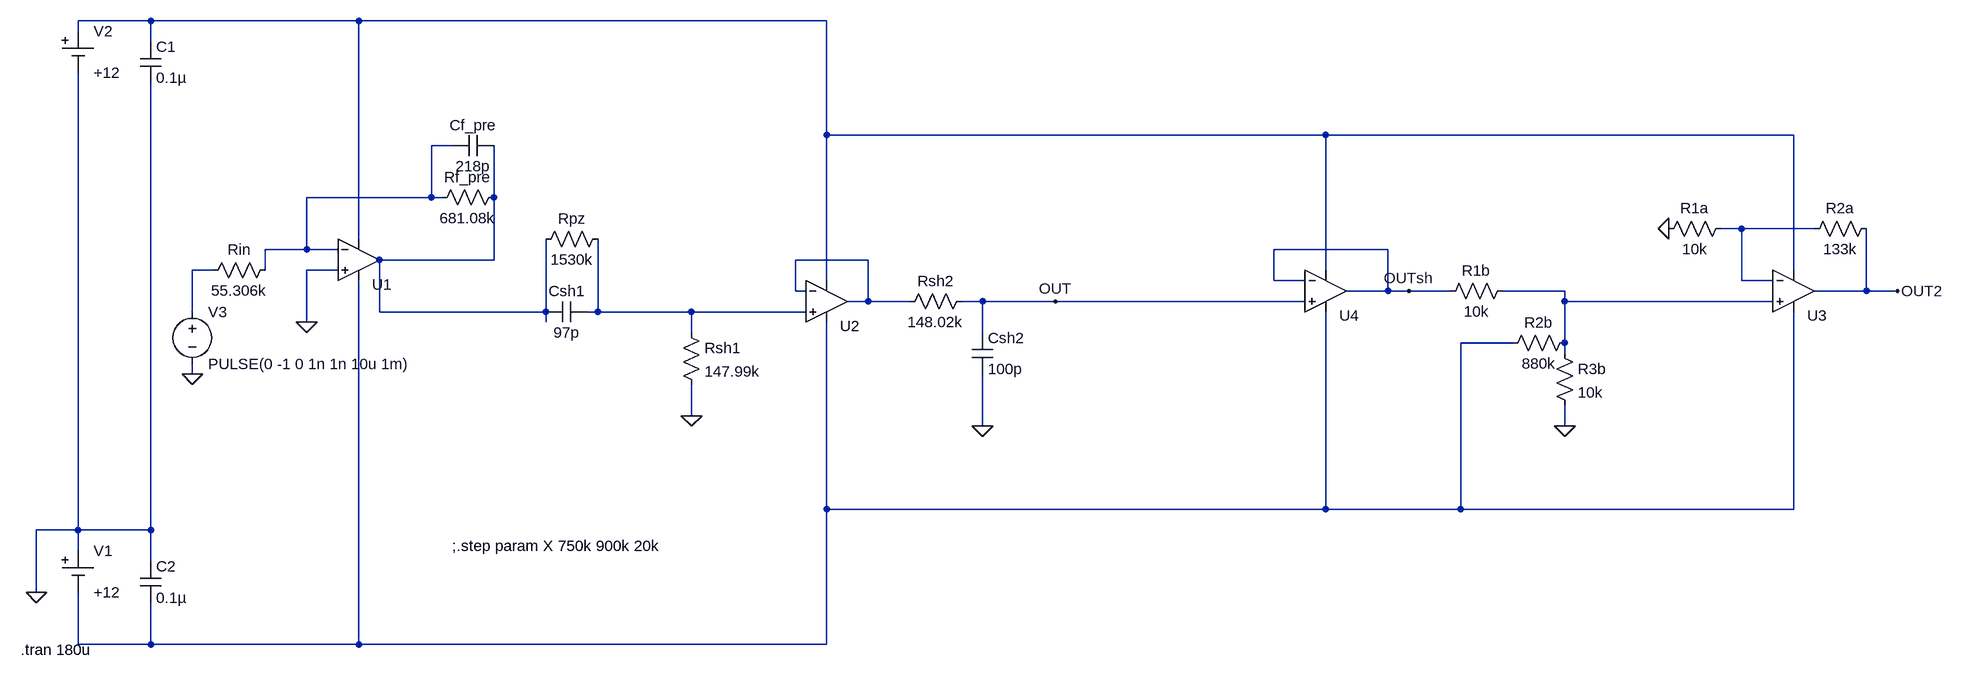
[diagram p0: schematic Circ_4.asc]
Circ_4.asc, the LTspice schematic file:
Version 4
SHEET 1 2336 680
WIRE -432 -624 -544 -624
WIRE -112 -624 -432 -624
WIRE 608 -624 -112 -624
WIRE -544 -608 -544 -624
WIRE -432 -592 -432 -624
WIRE 608 -448 608 -624
WIRE 1376 -448 608 -448
WIRE 2096 -448 1376 -448
WIRE 32 -432 0 -432
WIRE 0 -352 0 -432
WIRE 0 -352 -192 -352
WIRE 16 -352 0 -352
WIRE 96 -352 96 -432
WIRE 2016 -304 1984 -304
WIRE 2128 -304 2016 -304
WIRE -112 -288 -112 -624
WIRE -192 -272 -192 -352
WIRE -192 -272 -256 -272
WIRE -144 -272 -192 -272
WIRE 1472 -272 1296 -272
WIRE 96 -256 96 -352
WIRE 96 -256 -80 -256
WIRE 672 -256 560 -256
WIRE -336 -240 -368 -240
WIRE -256 -240 -256 -272
WIRE -144 -240 -192 -240
WIRE 1376 -240 1376 -448
WIRE 2096 -240 2096 -448
WIRE 608 -224 608 -448
WIRE 1296 -224 1296 -272
WIRE 1344 -224 1296 -224
WIRE 2016 -224 2016 -304
WIRE 2064 -224 2016 -224
WIRE 560 -208 560 -256
WIRE 576 -208 560 -208
WIRE 1472 -208 1472 -272
WIRE 1472 -208 1408 -208
WIRE 1504 -208 1472 -208
WIRE 1568 -208 1504 -208
WIRE 1744 -208 1648 -208
WIRE 2208 -208 2208 -304
WIRE 2208 -208 2128 -208
WIRE 2256 -208 2208 -208
WIRE 672 -192 672 -256
WIRE 672 -192 640 -192
WIRE 736 -192 672 -192
WIRE 848 -192 816 -192
WIRE 960 -192 848 -192
WIRE 1344 -192 960 -192
WIRE 1744 -192 1744 -208
WIRE 2064 -192 1744 -192
WIRE -368 -176 -368 -240
WIRE -80 -176 -80 -256
WIRE 176 -176 176 -288
WIRE 176 -176 -80 -176
WIRE 256 -176 256 -288
WIRE 256 -176 240 -176
WIRE 400 -176 256 -176
WIRE 576 -176 400 -176
WIRE -192 -160 -192 -240
WIRE 176 -160 176 -176
WIRE 400 -144 400 -176
WIRE 848 -144 848 -192
WIRE 1664 -128 1584 -128
WIRE 1744 -128 1744 -192
WIRE 1744 -112 1744 -128
WIRE -368 -80 -368 -96
WIRE 400 -16 400 -64
WIRE 848 0 848 -80
WIRE 1744 0 1744 -32
WIRE 608 128 608 -160
WIRE 1376 128 1376 -176
WIRE 1376 128 608 128
WIRE 1584 128 1584 -128
WIRE 1584 128 1376 128
WIRE 2096 128 2096 -176
WIRE 2096 128 1584 128
WIRE -544 160 -544 -544
WIRE -544 160 -608 160
WIRE -432 160 -432 -528
WIRE -432 160 -544 160
WIRE -544 192 -544 160
WIRE -432 208 -432 160
WIRE -608 256 -608 160
WIRE -544 336 -544 256
WIRE -432 336 -432 272
WIRE -432 336 -544 336
WIRE -112 336 -112 -224
WIRE -112 336 -432 336
WIRE 608 336 608 128
WIRE 608 336 -112 336
FLAG -608 256 0
FLAG 400 -16 0
FLAG 848 0 0
FLAG 960 -192 OUT
FLAG -368 -80 0
FLAG -192 -160 0
FLAG 2256 -208 OUT2
FLAG 1904 -304 0
FLAG 1744 0 0
FLAG 1504 -208 OUTsh
SYMBOL cap -448 208 R0
SYMATTR InstName C2
SYMATTR Value 0.1µ
SYMBOL Misc\\cell -544 192 R0
WINDOW 123 0 0 Left 0
WINDOW 39 0 0 Left 0
SYMATTR InstName V1
SYMATTR Value +12
SYMBOL Misc\\cell -544 -608 R0
WINDOW 123 0 0 Left 0
WINDOW 39 0 0 Left 0
SYMATTR InstName V2
SYMATTR Value +12
SYMBOL cap -448 -592 R0
SYMATTR InstName C1
SYMATTR Value 0.1µ
SYMBOL Opamps/UniversalOpamp2 608 -192 R0
WINDOW 0 21 38 Left 2
SYMATTR InstName U2
SYMBOL cap 240 -192 R90
WINDOW 0 0 32 VBottom 2
WINDOW 3 32 32 VTop 2
SYMATTR InstName Csh1
SYMATTR Value 97p
SYMBOL res 384 -160 R0
SYMATTR InstName Rsh1
SYMATTR Value 147.99k
SYMBOL res 832 -208 R90
WINDOW 0 0 56 VBottom 2
WINDOW 3 32 56 VTop 2
SYMATTR InstName Rsh2
SYMATTR Value 148.02k
SYMBOL cap 832 -144 R0
SYMATTR InstName Csh2
SYMATTR Value 100p
SYMBOL Opamps/UniversalOpamp2 -112 -256 R0
WINDOW 0 21 38 Left 2
SYMATTR InstName U1
SYMBOL res 112 -368 R90
WINDOW 0 0 56 VBottom 2
WINDOW 3 32 56 VTop 2
SYMATTR InstName Rf_pre
SYMATTR Value 681.08k
SYMBOL cap 96 -448 R90
WINDOW 0 0 32 VBottom 2
WINDOW 3 32 32 VTop 2
SYMATTR InstName Cf_pre
SYMATTR Value 218p
SYMBOL res -240 -256 R90
WINDOW 0 0 56 VBottom 2
WINDOW 3 32 56 VTop 2
SYMATTR InstName Rin
SYMATTR Value 55.306k
SYMBOL voltage -368 -192 R0
WINDOW 123 0 0 Left 0
WINDOW 39 0 0 Left 0
SYMATTR InstName V3
SYMATTR Value PULSE(0 -1 0 1n 1n 10u 1m)
SYMBOL res 272 -304 R90
WINDOW 0 0 56 VBottom 2
WINDOW 3 32 56 VTop 2
SYMATTR InstName Rpz
SYMATTR Value 1530k
SYMBOL Opamps/UniversalOpamp2 2096 -208 R0
WINDOW 0 21 38 Left 2
SYMATTR InstName U3
SYMBOL res 2224 -320 R90
WINDOW 0 0 56 VBottom 2
WINDOW 3 32 56 VTop 2
SYMATTR InstName R2a
SYMATTR Value 133k
SYMBOL res 2000 -320 R90
WINDOW 0 0 56 VBottom 2
WINDOW 3 32 56 VTop 2
SYMATTR InstName R1a
SYMATTR Value 10k
SYMBOL Opamps/UniversalOpamp2 1376 -208 R0
WINDOW 0 21 38 Left 2
SYMATTR InstName U4
SYMBOL res 1728 -128 R0
SYMATTR InstName R3b
SYMATTR Value 10k
SYMBOL res 1760 -144 R90
WINDOW 0 0 56 VBottom 2
WINDOW 3 32 56 VTop 2
SYMATTR InstName R2b
SYMATTR Value 880k
SYMBOL res 1664 -224 R90
WINDOW 0 0 56 VBottom 2
WINDOW 3 32 56 VTop 2
SYMATTR InstName R1b
SYMATTR Value 10k
TEXT -632 344 Left 2 !.tran 180u
TEXT 32 184 Left 2 !;.step param X 750k 900k 20k

The netlist it stands for:
* Circ_4.asc
C2 0 N009 0.1µ
V1 0 N009 +12
V2 N001 0 +12
C1 N001 0 0.1µ
XU2 N008 N005 N001 N009 N005 level.2 Avol=1Meg GBW=10Meg Slew=10Meg ilimit=25m rail=0 Vos=0 phimargin=45 en=0 enk=0 in=0 ink=0 Rin=500Meg  ; pins IN+ IN- V+ V- OUT
Csh1 N008 N003 97p
Rsh1 N008 0 147.99k
Rsh2 OUT N005 148.02k
Csh2 OUT 0 100p
XU1 0 N002 N001 N009 N003 level.2 Avol=1Meg GBW=10Meg Slew=10Meg ilimit=25m rail=0 Vos=0 phimargin=45 en=0 enk=0 in=0 ink=0 Rin=500Meg  ; pins IN+ IN- V+ V- OUT
Rf_pre N003 N002 681.08k
Cf_pre N003 N002 218p
Rin N002 N006 55.306k
V3 N006 0 PULSE(0 -1 0 1n 1n 10u 1m)
Rpz N008 N003 1530k
XU3 N007 N004 N001 N009 OUT2 level.2 Avol=1Meg GBW=10Meg Slew=10Meg ilimit=25m rail=0 Vos=0 phimargin=45 en=0 enk=0 in=0 ink=0 Rin=500Meg  ; pins IN+ IN- V+ V- OUT
R2a OUT2 N004 133k
R1a N004 0 10k
XU4 OUT OUTsh N001 N009 OUTsh level.2 Avol=1Meg GBW=10Meg Slew=10Meg ilimit=25m rail=0 Vos=0 phimargin=45 en=0 enk=0 in=0 ink=0 Rin=500Meg  ; pins IN+ IN- V+ V- OUT
R3b N007 0 10k
R2b N007 N009 880k
R1b N007 OUTsh 10k
.tran 180u
;.step param X 750k 900k 20k
.lib UniversalOpamps2.sub
.backanno
.end